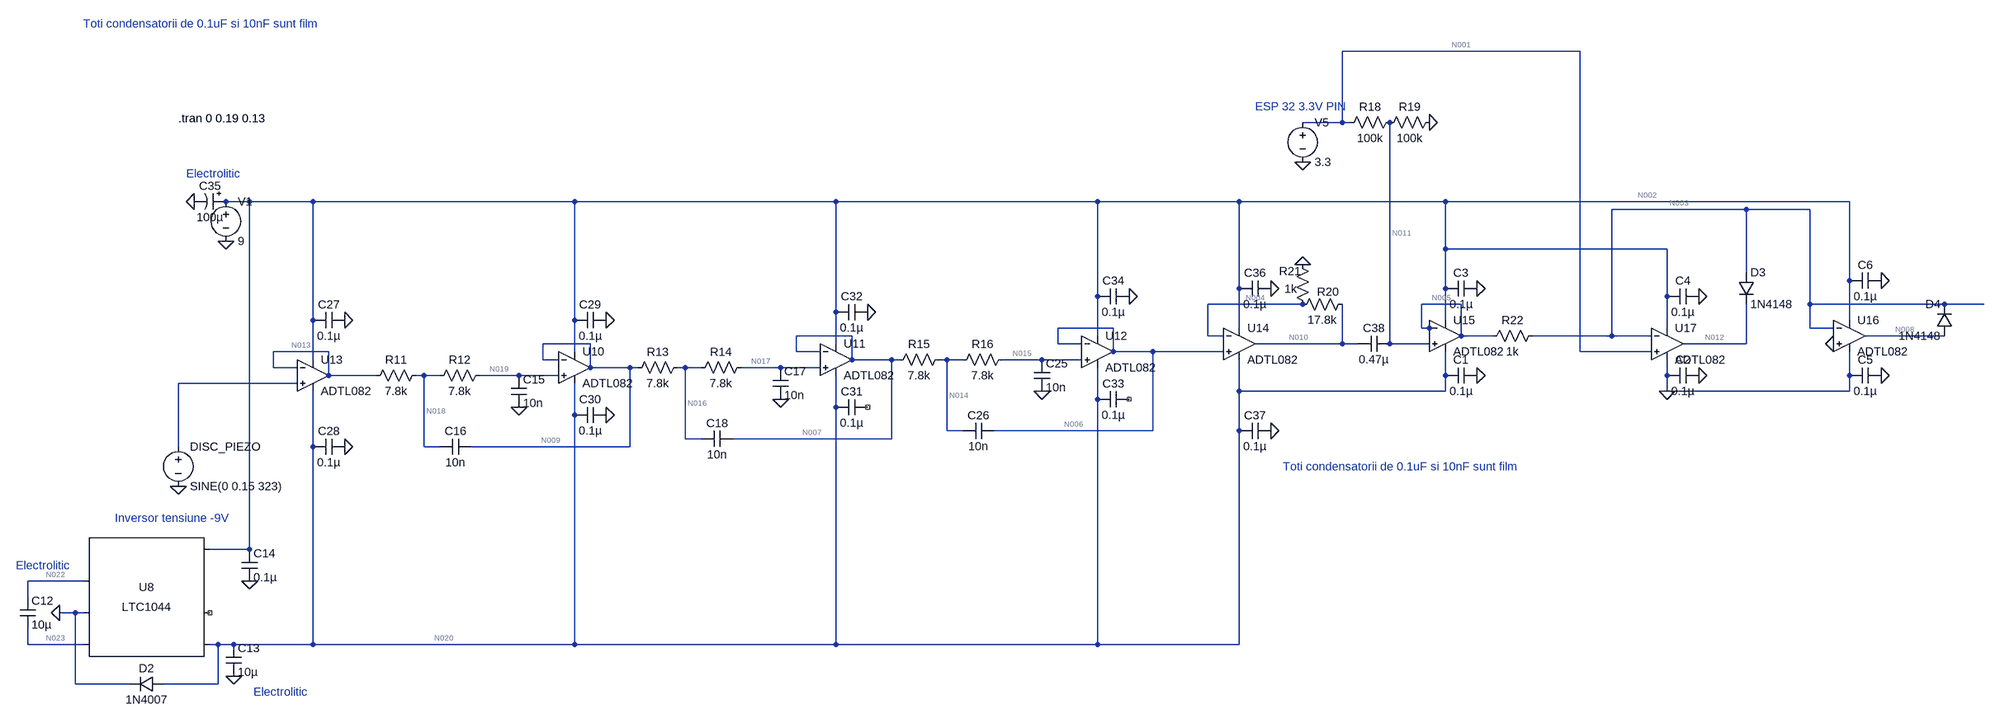
[diagram p0: schematic circuit_LTspice.asc]
circuit_LTspice.asc, the LTspice schematic file:
Version 4
SHEET 1 7580 2904
WIRE 4032 1376 3552 1376
WIRE 3552 1520 3552 1376
WIRE 3552 1520 3472 1520
WIRE 3568 1520 3552 1520
WIRE 1264 1680 1216 1680
WIRE 1392 1680 1264 1680
WIRE 1920 1680 1392 1680
WIRE 2448 1680 1920 1680
WIRE 2976 1680 2448 1680
WIRE 3344 1680 2976 1680
WIRE 3760 1680 3344 1680
WIRE 4576 1680 3760 1680
WIRE 4368 1696 4096 1696
WIRE 4496 1696 4368 1696
WIRE 3760 1776 3760 1680
WIRE 4208 1776 3760 1776
WIRE 4368 1824 4368 1696
WIRE 4576 1840 4576 1680
WIRE 3344 1856 3344 1680
WIRE 3760 1856 3760 1776
WIRE 2976 1872 2976 1680
WIRE 4208 1872 4208 1776
WIRE 3472 1888 3280 1888
WIRE 3792 1888 3712 1888
WIRE 4496 1888 4496 1696
WIRE 4768 1888 4496 1888
WIRE 4848 1888 4768 1888
WIRE 2448 1904 2448 1680
WIRE 1392 1920 1392 1680
WIRE 1920 1920 1920 1680
WIRE 3760 1920 3760 1856
WIRE 4576 1920 4576 1840
WIRE 3008 1936 2896 1936
WIRE 3344 1936 3344 1856
WIRE 3712 1936 3712 1888
WIRE 3728 1936 3712 1936
WIRE 3744 1936 3728 1936
WIRE 4208 1936 4208 1872
WIRE 4496 1936 4496 1888
WIRE 4544 1936 4496 1936
WIRE 2480 1952 2368 1952
WIRE 2976 1952 2976 1872
WIRE 3280 1952 3280 1888
WIRE 3312 1952 3280 1952
WIRE 3792 1952 3792 1888
WIRE 3856 1952 3792 1952
WIRE 4096 1952 4096 1696
WIRE 4096 1952 3936 1952
WIRE 4176 1952 4096 1952
WIRE 4768 1952 4608 1952
WIRE 1952 1968 1856 1968
WIRE 2448 1968 2448 1904
WIRE 2896 1968 2896 1936
WIRE 2944 1968 2896 1968
WIRE 3552 1968 3552 1888
WIRE 3552 1968 3376 1968
WIRE 3584 1968 3552 1968
WIRE 3648 1968 3648 1520
WIRE 3728 1968 3648 1968
WIRE 4368 1968 4368 1888
WIRE 4368 1968 4240 1968
WIRE 1424 1984 1312 1984
WIRE 1920 1984 1920 1920
WIRE 2368 1984 2368 1952
WIRE 2416 1984 2368 1984
WIRE 3008 1984 3008 1936
WIRE 3088 1984 3008 1984
WIRE 3312 1984 3088 1984
WIRE 4032 1984 4032 1376
WIRE 4176 1984 4032 1984
WIRE 1392 2000 1392 1920
WIRE 1856 2000 1856 1968
WIRE 1888 2000 1856 2000
WIRE 2480 2000 2480 1952
WIRE 2560 2000 2480 2000
WIRE 2576 2000 2560 2000
WIRE 2672 2000 2656 2000
WIRE 2704 2000 2672 2000
WIRE 2864 2000 2784 2000
WIRE 2944 2000 2864 2000
WIRE 1312 2016 1312 1984
WIRE 1360 2016 1312 2016
WIRE 1952 2016 1952 1968
WIRE 2032 2016 1952 2016
WIRE 2048 2016 2032 2016
WIRE 2144 2016 2128 2016
WIRE 2176 2016 2144 2016
WIRE 2336 2016 2256 2016
WIRE 2416 2016 2336 2016
WIRE 1424 2032 1424 1984
WIRE 1520 2032 1424 2032
WIRE 1616 2032 1600 2032
WIRE 1648 2032 1616 2032
WIRE 1808 2032 1728 2032
WIRE 1888 2032 1808 2032
WIRE 3760 2032 3760 1984
WIRE 4208 2032 4208 2000
WIRE 4576 2032 4576 1984
WIRE 1360 2048 1120 2048
WIRE 3344 2064 3344 2000
WIRE 3760 2064 3760 2032
WIRE 3760 2064 3344 2064
WIRE 4208 2064 4208 2032
WIRE 4576 2064 4576 2032
WIRE 4576 2064 4208 2064
WIRE 2976 2080 2976 2016
WIRE 2448 2096 2448 2032
WIRE 1920 2112 1920 2048
WIRE 2672 2144 2672 2000
WIRE 2704 2144 2672 2144
WIRE 3088 2144 3088 1984
WIRE 3088 2144 2768 2144
WIRE 3344 2144 3344 2064
WIRE 2144 2160 2144 2016
WIRE 2176 2160 2144 2160
WIRE 2560 2160 2560 2000
WIRE 2560 2160 2240 2160
WIRE 1120 2176 1120 2048
WIRE 1392 2176 1392 2064
WIRE 1616 2176 1616 2032
WIRE 1648 2176 1616 2176
WIRE 2032 2176 2032 2016
WIRE 2032 2176 1712 2176
WIRE 1264 2384 1264 1680
WIRE 1264 2384 1184 2384
WIRE 928 2448 816 2448
WIRE 816 2480 816 2448
WIRE 912 2512 880 2512
WIRE 928 2512 912 2512
WIRE 816 2576 816 2544
WIRE 928 2576 816 2576
WIRE 1200 2576 1184 2576
WIRE 1232 2576 1200 2576
WIRE 1392 2576 1392 2176
WIRE 1392 2576 1232 2576
WIRE 1920 2576 1920 2112
WIRE 1920 2576 1392 2576
WIRE 2448 2576 2448 2096
WIRE 2448 2576 1920 2576
WIRE 2976 2576 2976 2080
WIRE 2976 2576 2448 2576
WIRE 3344 2576 3344 2144
WIRE 3344 2576 2976 2576
WIRE 912 2656 912 2512
WIRE 1024 2656 912 2656
WIRE 1200 2656 1200 2576
WIRE 1200 2656 1088 2656
FLAG 880 2512 0
FLAG 1232 2640 0
FLAG 1264 2448 0
FLAG 1808 2096 0
FLAG 2336 2080 0
FLAG 2864 2064 0
FLAG 1216 1760 0
FLAG 1152 1680 0
FLAG 1456 1920 0
FLAG 1456 2176 0
FLAG 1984 1920 0
FLAG 2512 1904 0
FLAG 3040 1872 0
FLAG 1984 2112 0
FLAG 1120 2256 0
FLAG 3408 1856 0
FLAG 3408 2144 0
FLAG 3472 1808 0
FLAG 3472 1600 0
FLAG 3728 1520 0
FLAG 4544 1968 0
FLAG 4208 2064 0
FLAG 3824 2032 0
FLAG 4272 2032 0
FLAG 3824 1856 0
FLAG 4272 1872 0
FLAG 4640 2032 0
FLAG 4640 1840 0
SYMBOL PowerProducts\\LTC1044 1056 2480 R0
SYMATTR InstName U8
SYMBOL diode 1088 2640 R90
WINDOW 0 0 32 VBottom 2
WINDOW 3 32 32 VTop 2
SYMATTR InstName D2
SYMATTR Value 1N4007
SYMBOL cap 800 2480 R0
SYMATTR InstName C12
SYMATTR Value 10µ
SYMBOL cap 1216 2576 R0
SYMATTR InstName C13
SYMATTR Value 10µ
SYMBOL cap 1248 2384 R0
SYMATTR InstName C14
SYMATTR Value 0.1µ
SYMBOL OpAmps\\ADTL082 1392 1968 R0
SYMATTR InstName U13
SYMBOL res 1616 2016 R90
WINDOW 0 0 56 VBottom 2
WINDOW 3 32 56 VTop 2
SYMATTR InstName R11
SYMATTR Value 7.8k
SYMBOL res 1744 2016 R90
WINDOW 0 0 56 VBottom 2
WINDOW 3 32 56 VTop 2
SYMATTR InstName R12
SYMATTR Value 7.8k
SYMBOL cap 1792 2032 R0
SYMATTR InstName C15
SYMATTR Value 10n
SYMBOL cap 1648 2192 R270
WINDOW 0 32 32 VTop 2
WINDOW 3 0 32 VBottom 2
SYMATTR InstName C16
SYMATTR Value 10n
SYMBOL OpAmps\\ADTL082 1920 1952 R0
SYMATTR InstName U10
SYMBOL res 2272 2000 R90
WINDOW 0 0 56 VBottom 2
WINDOW 3 32 56 VTop 2
SYMATTR InstName R14
SYMATTR Value 7.8k
SYMBOL cap 2320 2016 R0
SYMATTR InstName C17
SYMATTR Value 10n
SYMBOL cap 2176 2176 R270
WINDOW 0 32 32 VTop 2
WINDOW 3 0 32 VBottom 2
SYMATTR InstName C18
SYMATTR Value 10n
SYMBOL OpAmps\\ADTL082 2448 1936 R0
SYMATTR InstName U11
SYMBOL res 2672 1984 R90
WINDOW 0 0 56 VBottom 2
WINDOW 3 32 56 VTop 2
SYMATTR InstName R15
SYMATTR Value 7.8k
SYMBOL res 2800 1984 R90
WINDOW 0 0 56 VBottom 2
WINDOW 3 32 56 VTop 2
SYMATTR InstName R16
SYMATTR Value 7.8k
SYMBOL cap 2848 2000 R0
SYMATTR InstName C25
SYMATTR Value 10n
SYMBOL cap 2704 2160 R270
WINDOW 0 32 32 VTop 2
WINDOW 3 0 32 VBottom 2
SYMATTR InstName C26
SYMATTR Value 10n
SYMBOL OpAmps\\ADTL082 2976 1920 R0
SYMATTR InstName U12
SYMBOL cap 1456 1904 R90
WINDOW 0 0 32 VBottom 2
WINDOW 3 32 32 VTop 2
SYMATTR InstName C27
SYMATTR Value 0.1µ
SYMBOL cap 1456 2160 R90
WINDOW 0 0 32 VBottom 2
WINDOW 3 32 32 VTop 2
SYMATTR InstName C28
SYMATTR Value 0.1µ
SYMBOL cap 1984 1904 R90
WINDOW 0 0 32 VBottom 2
WINDOW 3 32 32 VTop 2
SYMATTR InstName C29
SYMATTR Value 0.1µ
SYMBOL cap 1984 2096 R90
WINDOW 0 0 32 VBottom 2
WINDOW 3 32 32 VTop 2
SYMATTR InstName C30
SYMATTR Value 0.1µ
SYMBOL cap 2512 2080 R90
WINDOW 0 0 32 VBottom 2
WINDOW 3 32 32 VTop 2
SYMATTR InstName C31
SYMATTR Value 0.1µ
SYMBOL cap 2512 1888 R90
WINDOW 0 0 32 VBottom 2
WINDOW 3 32 32 VTop 2
SYMATTR InstName C32
SYMATTR Value 0.1µ
SYMBOL cap 3040 2064 R90
WINDOW 0 0 32 VBottom 2
WINDOW 3 32 32 VTop 2
SYMATTR InstName C33
SYMATTR Value 0.1µ
SYMBOL cap 3040 1856 R90
WINDOW 0 0 32 VBottom 2
WINDOW 3 32 32 VTop 2
SYMATTR InstName C34
SYMATTR Value 0.1µ
SYMBOL voltage 1216 1664 R0
WINDOW 123 0 0 Left 0
WINDOW 39 0 0 Left 0
SYMATTR InstName V1
SYMATTR Value 9
SYMBOL polcap 1216 1664 R90
WINDOW 0 0 32 VBottom 2
WINDOW 3 32 32 VTop 2
SYMATTR InstName C35
SYMATTR Value 100µ
SYMATTR Description Capacitor
SYMATTR Type cap
SYMATTR SpiceLine V=16 Irms=1.07 Rser=0.0308 Lser=5.229n
SYMBOL voltage 1120 2160 R0
WINDOW 123 0 0 Left 0
WINDOW 39 0 0 Left 0
SYMATTR InstName DISC_PIEZO
SYMATTR Value SINE(0 0.15 323)
SYMBOL OpAmps\\ADTL082 3344 1904 R0
SYMATTR InstName U14
SYMBOL cap 3408 1840 R90
WINDOW 0 0 32 VBottom 2
WINDOW 3 32 32 VTop 2
SYMATTR InstName C36
SYMATTR Value 0.1µ
SYMBOL cap 3408 2128 R90
WINDOW 0 0 32 VBottom 2
WINDOW 3 32 32 VTop 2
SYMATTR InstName C37
SYMATTR Value 0.1µ
SYMBOL res 3456 1792 R0
WINDOW 0 45 71 Left 2
WINDOW 3 -21 65 Left 2
SYMATTR InstName R20
SYMATTR Value 1k
SYMBOL res 3568 1872 R90
WINDOW 0 -35 121 VBottom 2
WINDOW 3 32 56 VTop 2
SYMATTR InstName R21
SYMATTR Value 17.8k
SYMBOL OpAmps\\ADTL082 3760 1888 R0
SYMATTR InstName U15
SYMBOL cap 3648 1952 R90
WINDOW 0 0 32 VBottom 2
WINDOW 3 32 32 VTop 2
SYMATTR InstName C38
SYMATTR Value 0.47µ
SYMBOL res 2144 2000 R90
WINDOW 0 0 56 VBottom 2
WINDOW 3 32 56 VTop 2
SYMATTR InstName R13
SYMATTR Value 7.8k
SYMBOL voltage 3472 1504 R0
WINDOW 123 0 0 Left 0
WINDOW 39 0 0 Left 0
SYMATTR InstName V5
SYMATTR Value 3.3
SYMBOL res 3664 1504 R90
WINDOW 0 0 56 VBottom 2
WINDOW 3 32 56 VTop 2
SYMATTR InstName R18
SYMATTR Value 100k
SYMBOL res 3744 1504 R90
WINDOW 0 0 56 VBottom 2
WINDOW 3 32 56 VTop 2
SYMATTR InstName R19
SYMATTR Value 100k
SYMBOL diode 4352 1824 R0
SYMATTR InstName D3
SYMATTR Value 1N4148
SYMBOL OpAmps\\ADTL082 4208 1904 R0
SYMATTR InstName U17
SYMBOL res 3952 1936 R90
WINDOW 0 0 56 VBottom 2
WINDOW 3 32 56 VTop 2
SYMATTR InstName R22
SYMATTR Value 1k
SYMBOL OpAmps\\ADTL082 4576 1888 R0
SYMATTR InstName U16
SYMBOL diode 4784 1952 R180
WINDOW 0 24 64 Left 2
WINDOW 3 24 0 Left 2
SYMATTR InstName D4
SYMATTR Value 1N4148
SYMBOL cap 3824 2016 R90
WINDOW 0 0 32 VBottom 2
WINDOW 3 32 32 VTop 2
SYMATTR InstName C1
SYMATTR Value 0.1µ
SYMBOL cap 4272 2016 R90
WINDOW 0 0 32 VBottom 2
WINDOW 3 32 32 VTop 2
SYMATTR InstName C2
SYMATTR Value 0.1µ
SYMBOL cap 3824 1840 R90
WINDOW 0 0 32 VBottom 2
WINDOW 3 32 32 VTop 2
SYMATTR InstName C3
SYMATTR Value 0.1µ
SYMBOL cap 4272 1856 R90
WINDOW 0 0 32 VBottom 2
WINDOW 3 32 32 VTop 2
SYMATTR InstName C4
SYMATTR Value 0.1µ
SYMBOL cap 4640 2016 R90
WINDOW 0 0 32 VBottom 2
WINDOW 3 32 32 VTop 2
SYMATTR InstName C5
SYMATTR Value 0.1µ
SYMBOL cap 4640 1824 R90
WINDOW 0 0 32 VBottom 2
WINDOW 3 32 32 VTop 2
SYMATTR InstName C6
SYMATTR Value 0.1µ
TEXT 1120 1512 Left 2 !.tran 0 0.19 0.13
TEXT 992 2320 Left 2 ;Inversor tensiune -9V
TEXT 3376 1488 Left 2 ;ESP 32 3.3V PIN
TEXT 1136 1624 Left 2 ;Electrolitic
TEXT 1272 2672 Left 2 ;Electrolitic
TEXT 792 2416 Left 2 ;Electrolitic
TEXT 3432 2216 Left 2 ;Toti condensatorii de 0.1uF si 10nF sunt film
TEXT 928 1320 Left 2 ;Toti condensatorii de 0.1uF si 10nF sunt film

The netlist it stands for:
* circuit_LTspice.asc
XU8 NC_01 N022 0 N023 N020 NC_02 NC_03 N002 LTC1044
D2 N020 0 1N4007
C12 N022 N023 10µ
C13 N020 0 10µ
C14 N002 0 0.1µ
XU13 N021 N013 N002 N020 N013 ADTL082  ; pins In+ In- V+ V- OUT
R11 N018 N013 7.8k
R12 N019 N018 7.8k
C15 N019 0 10n
C16 N018 N009 10n
XU10 N019 N009 N002 N020 N009 ADTL082  ; pins In+ In- V+ V- OUT
R14 N017 N016 7.8k
C17 N017 0 10n
C18 N016 N007 10n
XU11 N017 N007 N002 N020 N007 ADTL082  ; pins In+ In- V+ V- OUT
R15 N014 N007 7.8k
R16 N015 N014 7.8k
C25 N015 0 10n
C26 N014 N006 10n
XU12 N015 N006 N002 N020 N006 ADTL082  ; pins In+ In- V+ V- OUT
C27 0 N002 0.1µ
C28 0 N020 0.1µ
C29 0 N002 0.1µ
C30 0 N020 0.1µ
C31 NC_04 N020 0.1µ
C32 0 N002 0.1µ
C33 NC_05 N020 0.1µ
C34 0 N002 0.1µ
V1 N002 0 9
C35 N002 0 100µ V=16 Irms=1.07 Rser=0.0308 Lser=5.229n
V§DISC_PIEZO N021 0 SINE(0 0.15 323)
XU14 N006 N004 N002 N020 N010 ADTL082  ; pins In+ In- V+ V- OUT
C36 0 N002 0.1µ
C37 0 N020 0.1µ
R20 0 N004 1k
R21 N010 N004 17.8k
XU15 N011 N005 N002 N020 N005 ADTL082  ; pins In+ In- V+ V- OUT
C38 N011 N010 0.47µ
R13 N016 N009 7.8k
V5 N001 0 3.3
R18 N011 N001 100k
R19 0 N011 100k
D3 N003 N012 1N4148
XU17 N001 N003 N002 0 N012 ADTL082  ; pins In+ In- V+ V- OUT
R22 N003 N005 1k
XU16 0 N003 N002 0 N008 ADTL082  ; pins In+ In- V+ V- OUT
D4 N008 N003 1N4148
C1 0 N020 0.1µ
C2 0 0 0.1µ
C3 0 N002 0.1µ
C4 0 N002 0.1µ
C5 0 0 0.1µ
C6 0 N002 0.1µ
.model D D
.lib standard.dio
.tran 0 0.19 0.13
* Inversor tensiune -9V
* ESP 32 3.3V PIN
* Electrolitic
* Electrolitic
* Electrolitic
* Toti condensatorii de 0.1uF si 10nF sunt film
* Toti condensatorii de 0.1uF si 10nF sunt film
.lib LTC1044.sub
.lib ADI.lib
.backanno
.end

* Results of the author's LTspice run, read from the files saved beside the schematic
* Operating Point, zero values left out:
*   V(n022) = 9 V
*   V(n002) = 9 V
*   V(n023) = 10.75 nV
*   V(n020) = 692.9 mV
*   V(n013) = 1.936 V
*   V(n018) = 1.936 V
*   V(n019) = 1.936 V
*   V(n009) = 2.042 V
*   V(n017) = 2.042 V
*   V(n016) = 2.042 V
*   V(n007) = 2.147 V
*   V(n014) = 2.147 V
*   V(n015) = 2.147 V
*   V(n006) = 2.251 V
*   V(n004) = 408 mV
*   V(n010) = 7.671 V
*   V(n005) = 1.941 V
*   V(n011) = 1.65 V
*   V(n001) = 3.3 V
*   V(n003) = 1.941 V
*   V(n012) = 7.789 V
*   V(n008) = 1.243 V
*   I(D2) = 18.03 mA
*   I(D3) = -2.526 nA
*   I(D4) = -2.521 nA
*   I(R11) = 21.29 pA
*   I(R12) = 21.29 pA
*   I(R14) = 20.43 pA
*   I(R15) = 19.59 pA
*   I(R16) = 19.59 pA
*   I(R20) = -408 µA
*   I(R21) = 408 µA
*   I(R13) = 20.43 pA
*   I(R18) = -16.5 µA
*   I(R19) = -16.5 µA
*   I(R22) = 42.1 pA
*   I(V1) = -25.04 mA
*   I(Disc_piezo) = 44.31 pA
*   I(V5) = -16.5 µA